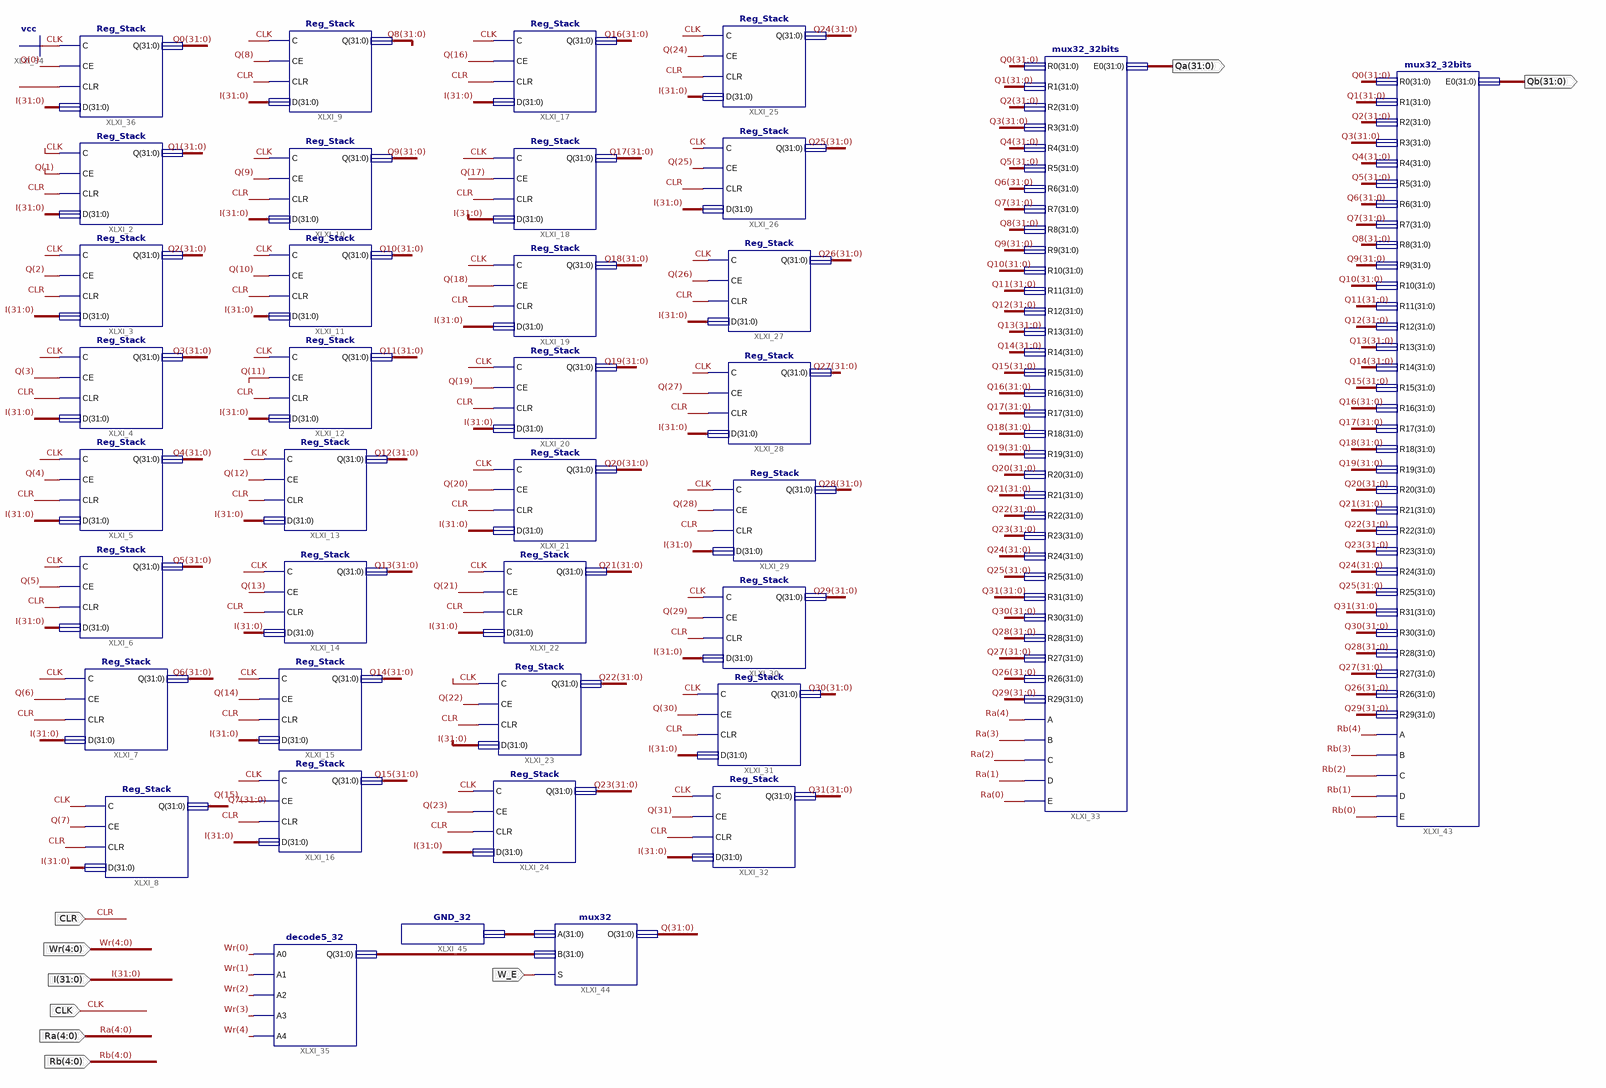
[diagram p0: schematic sheet 1]
// Xilinx ISE schematic Reg_Stack32.sch (artix7) as structural Verilog: 37 symbols, 9 ports
module Reg_Stack32 (
  input  CLR,
  input  [31:0] I,
  input  CLK,
  input  [4:0] Wr,
  input  [4:0] Ra,
  input  [4:0] Rb,
  input  W_E,
  output [31:0] Qa,
  output [31:0] Qb
);

  wire [31:0] Q, Q0, Q1, Q2, Q3, Q4, Q5, Q6, Q7, Q8, Q9, Q10, Q11, Q12, Q13, Q14, Q15, Q16, Q17, Q18, Q19,
       Q20, Q21, Q22, Q23, Q24, Q25, Q26, Q27, Q28, Q29, Q30, Q31, XLXN_427, XLXN_429;

  Reg_Stack XLXI_2 (.C(CLK), .CE(Q[1]), .CLR(CLR), .D(I), .Q(Q1));
  Reg_Stack XLXI_3 (.C(CLK), .CE(Q[2]), .CLR(CLR), .D(I), .Q(Q2));
  Reg_Stack XLXI_4 (.C(CLK), .CE(Q[3]), .CLR(CLR), .D(I), .Q(Q3));
  Reg_Stack XLXI_5 (.C(CLK), .CE(Q[4]), .CLR(CLR), .D(I), .Q(Q4));
  Reg_Stack XLXI_6 (.C(CLK), .CE(Q[5]), .CLR(CLR), .D(I), .Q(Q5));
  Reg_Stack XLXI_7 (.C(CLK), .CE(Q[6]), .CLR(CLR), .D(I), .Q(Q6));
  Reg_Stack XLXI_8 (.C(CLK), .CE(Q[7]), .CLR(CLR), .D(I), .Q(Q7));
  Reg_Stack XLXI_9 (.C(CLK), .CE(Q[8]), .CLR(CLR), .D(I), .Q(Q8));
  Reg_Stack XLXI_10 (.C(CLK), .CE(Q[9]), .CLR(CLR), .D(I), .Q(Q9));
  Reg_Stack XLXI_11 (.C(CLK), .CE(Q[10]), .CLR(CLR), .D(I), .Q(Q10));
  Reg_Stack XLXI_12 (.C(CLK), .CE(Q[11]), .CLR(CLR), .D(I), .Q(Q11));
  Reg_Stack XLXI_13 (.C(CLK), .CE(Q[12]), .CLR(CLR), .D(I), .Q(Q12));
  Reg_Stack XLXI_14 (.C(CLK), .CE(Q[13]), .CLR(CLR), .D(I), .Q(Q13));
  Reg_Stack XLXI_15 (.C(CLK), .CE(Q[14]), .CLR(CLR), .D(I), .Q(Q14));
  Reg_Stack XLXI_16 (.C(CLK), .CE(Q[15]), .CLR(CLR), .D(I), .Q(Q15));
  Reg_Stack XLXI_17 (.C(CLK), .CE(Q[16]), .CLR(CLR), .D(I), .Q(Q16));
  Reg_Stack XLXI_18 (.C(CLK), .CE(Q[17]), .CLR(CLR), .D(I), .Q(Q17));
  Reg_Stack XLXI_19 (.C(CLK), .CE(Q[18]), .CLR(CLR), .D(I), .Q(Q18));
  Reg_Stack XLXI_20 (.C(CLK), .CE(Q[19]), .CLR(CLR), .D(I), .Q(Q19));
  Reg_Stack XLXI_21 (.C(CLK), .CE(Q[20]), .CLR(CLR), .D(I), .Q(Q20));
  Reg_Stack XLXI_22 (.C(CLK), .CE(Q[21]), .CLR(CLR), .D(I), .Q(Q21));
  Reg_Stack XLXI_23 (.C(CLK), .CE(Q[22]), .CLR(CLR), .D(I), .Q(Q22));
  Reg_Stack XLXI_24 (.C(CLK), .CE(Q[23]), .CLR(CLR), .D(I), .Q(Q23));
  Reg_Stack XLXI_25 (.C(CLK), .CE(Q[24]), .CLR(CLR), .D(I), .Q(Q24));
  Reg_Stack XLXI_26 (.C(CLK), .CE(Q[25]), .CLR(CLR), .D(I), .Q(Q25));
  Reg_Stack XLXI_27 (.C(CLK), .CE(Q[26]), .CLR(CLR), .D(I), .Q(Q26));
  Reg_Stack XLXI_28 (.C(CLK), .CE(Q[27]), .CLR(CLR), .D(I), .Q(Q27));
  Reg_Stack XLXI_29 (.C(CLK), .CE(Q[28]), .CLR(CLR), .D(I), .Q(Q28));
  Reg_Stack XLXI_30 (.C(CLK), .CE(Q[29]), .CLR(CLR), .D(I), .Q(Q29));
  Reg_Stack XLXI_31 (.C(CLK), .CE(Q[30]), .CLR(CLR), .D(I), .Q(Q30));
  Reg_Stack XLXI_32 (.C(CLK), .CE(Q[31]), .CLR(CLR), .D(I), .Q(Q31));
  Reg_Stack XLXI_36 (.C(CLK), .CE(Q[0]), .CLR(1'b1), .D(I), .Q(Q0));
  mux32_32bits XLXI_33 (
    .R0(Q0), .R1(Q1), .R2(Q2), .R3(Q3), .R4(Q4), .R5(Q5), .R6(Q6), .R7(Q7), .R8(Q8), .R9(Q9), .R10(Q10),
    .R11(Q11), .R12(Q12), .R13(Q13), .R14(Q14), .R15(Q15), .R16(Q16), .R17(Q17), .R18(Q18), .R19(Q19),
    .R20(Q20), .R21(Q21), .R22(Q22), .R23(Q23), .R24(Q24), .R25(Q25), .R31(Q31), .R30(Q30), .R28(Q28),
    .R27(Q27), .R26(Q26), .R29(Q29), .A(Ra[4]), .B(Ra[3]), .C(Ra[2]), .D(Ra[1]), .E(Ra[0]), .E0(Qa));
  mux32_32bits XLXI_43 (
    .R0(Q0), .R1(Q1), .R2(Q2), .R3(Q3), .R4(Q4), .R5(Q5), .R6(Q6), .R7(Q7), .R8(Q8), .R9(Q9), .R10(Q10),
    .R11(Q11), .R12(Q12), .R13(Q13), .R14(Q14), .R15(Q15), .R16(Q16), .R17(Q17), .R18(Q18), .R19(Q19),
    .R20(Q20), .R21(Q21), .R22(Q22), .R23(Q23), .R24(Q24), .R25(Q25), .R31(Q31), .R30(Q30), .R28(Q28),
    .R27(Q27), .R26(Q26), .R29(Q29), .A(Rb[4]), .B(Rb[3]), .C(Rb[2]), .D(Rb[1]), .E(Rb[0]), .E0(Qb));
  mux32 XLXI_44 (.A(XLXN_429), .B(XLXN_427), .S(W_E), .O(Q));
  GND_32 XLXI_45 (.GND_OUT(XLXN_429));
  decode5_32 XLXI_35 (.A0(Wr[0]), .A1(Wr[1]), .A2(Wr[2]), .A3(Wr[3]), .A4(Wr[4]), .Q(XLXN_427));
endmodule
